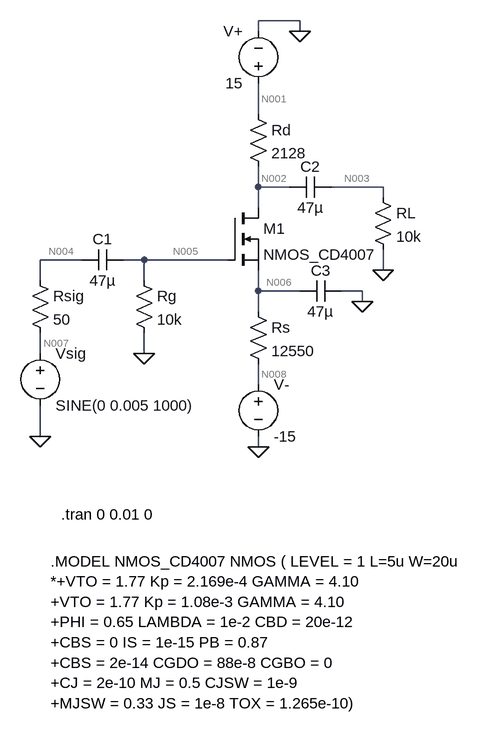
[diagram p0: schematic E1.asc]
E1.asc, the LTspice schematic file:
Version 4.1
SHEET 1 880 772
WIRE 320 -272 256 -272
WIRE 256 -256 256 -272
WIRE 320 -256 320 -272
WIRE 256 -128 256 -176
WIRE 256 -16 256 -48
WIRE 304 -16 256 -16
WIRE 448 -16 368 -16
WIRE 448 0 448 -16
WIRE 256 16 256 -16
WIRE -16 96 -80 96
WIRE 80 96 48 96
WIRE 208 96 80 96
WIRE 448 112 448 80
WIRE -80 128 -80 96
WIRE 80 128 80 96
WIRE 256 144 256 112
WIRE 320 144 256 144
WIRE 416 144 384 144
WIRE 416 160 416 144
WIRE 256 176 256 144
WIRE -80 240 -80 208
WIRE 80 240 80 208
WIRE 256 288 256 256
WIRE -80 368 -80 320
WIRE 256 384 256 368
FLAG -80 368 0
FLAG 80 240 0
FLAG 416 160 0
FLAG 448 112 0
FLAG 320 -256 0
FLAG 256 384 0
SYMBOL voltage -80 224 R0
WINDOW 123 0 0 Left 0
WINDOW 39 0 0 Left 0
SYMATTR InstName Vsig
SYMATTR Value SINE(0 0.005 1000)
SYMBOL res -96 112 R0
SYMATTR InstName Rsig
SYMATTR Value 50
SYMBOL cap 48 80 R90
WINDOW 0 0 32 VBottom 2
WINDOW 3 32 32 VTop 2
SYMATTR InstName C1
SYMATTR Value 47µ
SYMBOL res 64 112 R0
SYMATTR InstName Rg
SYMATTR Value 10k
SYMBOL nmos 208 16 R0
SYMATTR InstName M1
SYMATTR Value NMOS_CD4007
SYMBOL res 240 160 R0
SYMATTR InstName Rs
SYMATTR Value 12550
SYMBOL res 240 -144 R0
SYMATTR InstName Rd
SYMATTR Value 2128
SYMBOL res 432 -16 R0
SYMATTR InstName RL
SYMATTR Value 10k
SYMBOL cap 368 -32 R90
WINDOW 0 0 32 VBottom 2
WINDOW 3 32 32 VTop 2
SYMATTR InstName C2
SYMATTR Value 47µ
SYMBOL cap 384 128 R90
WINDOW 0 0 32 VBottom 2
WINDOW 3 32 32 VTop 2
SYMATTR InstName C3
SYMATTR Value 47µ
SYMBOL voltage 256 -160 R180
WINDOW 0 24 96 Left 2
WINDOW 3 24 16 Left 2
SYMATTR InstName V+
SYMATTR Value 15
SYMBOL voltage 256 272 R0
SYMATTR InstName V-
SYMATTR Value -15
TEXT -48 488 Left 2 !.tran 0 0.01 0
TEXT -64 560 Left 2 !.MODEL NMOS_CD4007 NMOS ( LEVEL = 1 L=5u W=20u\n*+VTO = 1.77 Kp = 2.169e-4 GAMMA = 4.10\n+VTO = 1.77 Kp = 1.08e-3 GAMMA = 4.10\n+PHI = 0.65 LAMBDA = 1e-2 CBD = 20e-12\n+CBS = 0 IS = 1e-15 PB = 0.87\n+CBS = 2e-14 CGDO = 88e-8 CGBO = 0\n+CJ = 2e-10 MJ = 0.5 CJSW = 1e-9\n+MJSW = 0.33 JS = 1e-8 TOX = 1.265e-10)

The netlist it stands for:
* E1.asc
Vsig N007 0 SINE(0 0.005 1000)
Rsig N004 N007 50
C1 N005 N004 47µ
Rg N005 0 10k
M1 N002 N005 N006 N006 NMOS_CD4007
Rs N006 N008 12550
Rd N001 N002 2128
RL N003 0 10k
C2 N003 N002 47µ
C3 0 N006 47µ
V+ N001 0 15
V- N008 0 -15
.model NMOS NMOS
.model PMOS PMOS
.lib standard.mos
.tran 0 0.01 0
.MODEL NMOS_CD4007 NMOS ( LEVEL = 1 L=5u W=20u
*+VTO = 1.77 Kp = 2.169e-4 GAMMA = 4.10
+VTO = 1.77 Kp = 1.08e-3 GAMMA = 4.10
+PHI = 0.65 LAMBDA = 1e-2 CBD = 20e-12
+CBS = 0 IS = 1e-15 PB = 0.87
+CBS = 2e-14 CGDO = 88e-8 CGBO = 0
+CJ = 2e-10 MJ = 0.5 CJSW = 1e-9
+MJSW = 0.33 JS = 1e-8 TOX = 1.265e-10)
.backanno
.end

* Results of the author's LTspice run, read from the files saved beside the schematic
* Operating Point, zero values left out:
*   V(n002) = 13.23 V
*   V(n006) = -4.56 V
*   V(n001) = 15 V
*   V(n008) = -15 V
*   Id(M1) = 831.8 µA
*   Is(M1) = -831.8 µA
*   Ib(M1) = -17.8 pA
*   I(V+) = -831.8 µA
*   I(Rs) = 831.8 µA
*   I(Rd) = 831.8 µA
*   I(V-) = 831.8 µA
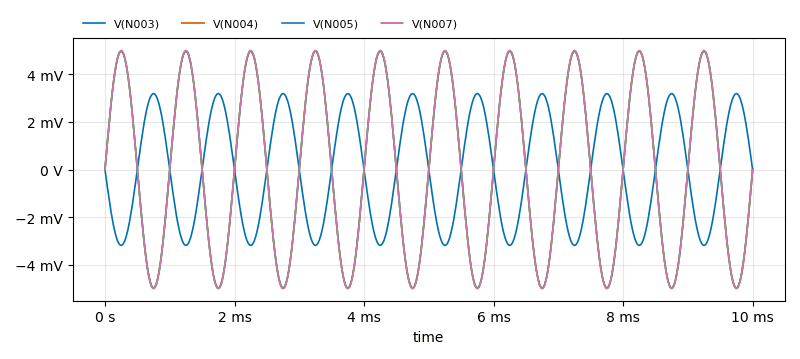
[diagram p1: Transient Analysis of E1.asc, plotted from the saved traces]
* Transient Analysis, 1 run:
*   V(N003): min -3.181 mV, max 3.189 mV, average 4.782 µV, rms 2.254 mV, last -476.1 nV
*   V(N004): min -4.975 mV, max 4.975 mV, average 9.172 nV, rms 3.521 mV, last 0 V
*   V(N005): min -4.977 mV, max 4.973 mV, average -1.657 µV, rms 3.521 mV, last 35.1 nV
*   V(N007): min -5 mV, max 5 mV, average 872.3 pV, rms 3.539 mV, last 0 V